# Altium schematic sheet LED.SchDoc: LED
size 420 x 297 mm; Date: March 14; CheckedBy: ThS. Bùi Quốc Bảo; DrawnBy: Nguyễn Gia Huy; Revision: V1.0; SheetNumber: 11; SheetTotal: 11; MasterProject: STM32-PLC; Sub-system: DA1_prj.PrjPcb
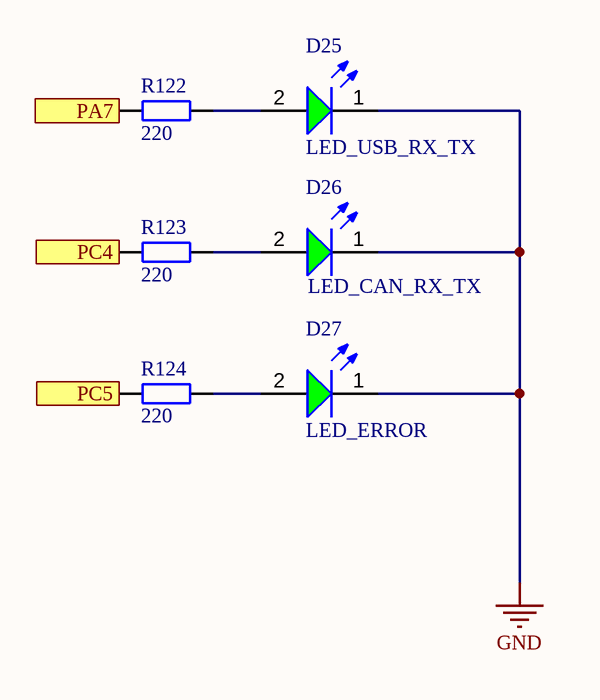
[diagram p0: LED.SchDoc]

## Parts
D25  LED_USB_RX_TX  [WL-SMCW_0603_150060xx75000]
D26  LED_CAN_RX_TX  [WL-SMCW_0603_150060xx75000]
D27  LED_ERROR  [WL-SMCW_0603_150060xx75000]
R122  220  [tro smd 0603]
R123  220  [tro smd 0603]
R124  220  [tro smd 0603]

## Ports
PA7 (see STM32_PLC[1B], STM32_PLC[5C]), PC4 (see STM32_PLC[2B], STM32_PLC[5C]), PC5 (see STM32_PLC[2B], STM32_PLC[5C])

## Nets
GND: D25.1(K) D26.1(K) D27.1(K)
PA7: R122.1 ; port PA7
PC4: R123.1 ; port PC4
PC5: R124.1 ; port PC5
NetD25_2: D25.2(A) R122.2
NetD26_2: D26.2(A) R123.2
NetD27_2: D27.2(A) R124.2

## Notes on the sheet
- Sub-system:
- Project:
- Design by:
- Sheet title:
- Sheet
- of
- Checked by:
- Approved by:
- Doc No:
- Revision:
- Size:
- Dates:
- A3

## Library data of the parts
D25-D27 = CMP-1426-00002-4: 430mcd Colorless transparence 520nm Emerald 140° LED0603 Light Emitting Diodes (LED) ROHS; Peak Wavelength: 515nm; Forward Current: 100mA; Reverse Voltage: 5V; Output Current: 10µA; Power Dissipation: 105mW; Lens Style: Clear, Rectangular; Dominant Wavelength: 525nm; Color: Green; Test Current: 20mA; Max Junction Temperature (Tj): 95°C; Forward Voltage: 3.2V; Width: 800µm; Max Operating Temperature: 85°C; Case Code (Metric): 1608; Luminous Intensity: 430mcd; Lead Free: Lead Free; Case/Package: 0603; Case Code (Imperial): 0603; Mount: Surface Mount; Max Reverse Voltage (DC): 5V; Packaging: Tape and Reel; RoHS: Compliant; Viewing Angle: 140°; REACH SVHC: Unknown; Min Operating Temperature: -40°C; Height: 700µm; Wavelength: 525nm; Length: 1.6mm
R122-R124 = Tro 0603 1% 10k: RES; Chung_Loai: Dán; Don_Vi: Con; So_Chan: 2; Ten_Linh_Kien: Trở 0603 1% 10k; Ma_Hang: MH006333; Kieu_Chan: *